# EAGLE design P1SwitchDemo (EAGLE 9.1.3)
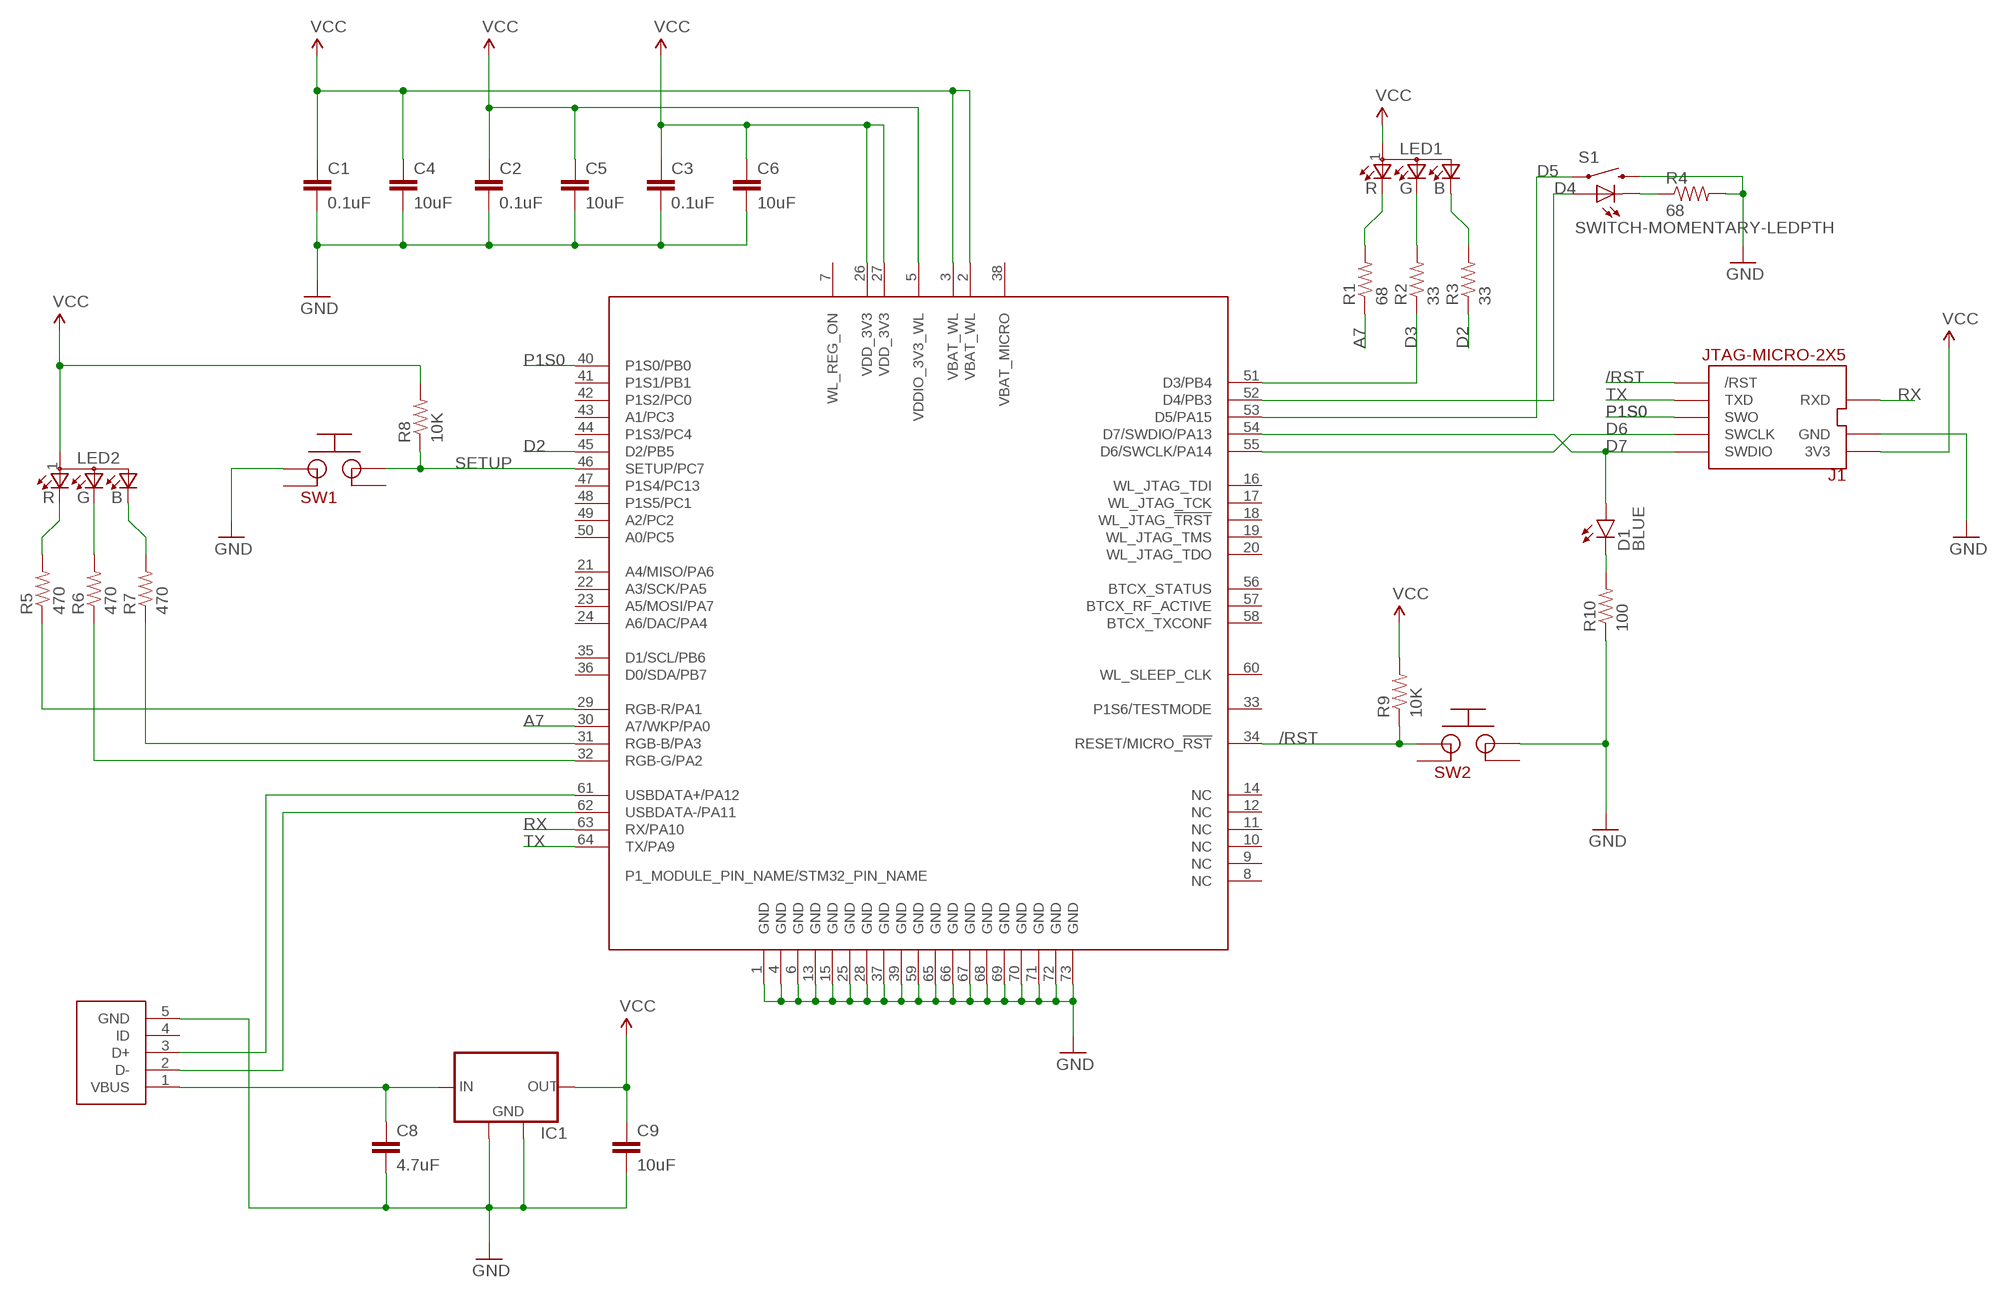
[diagram p0: schematic, sheet 1]

## Parts
C1  0.1uF  CAP-0.1UF-0603  [0603-CAP]
C2  0.1uF  CAP-0.1UF-0603  [0603-CAP]
C3  0.1uF  CAP-0.1UF-0603  [0603-CAP]
C4  10uF  CAP-10UF-0603  [0603-CAP]
C5  10uF  CAP-10UF-0603  [0603-CAP]
C6  10uF  CAP-10UF-0603  [0603-CAP]
C8  4.7uF  CAP-4.7UF-0603  [0603-CAP]
C9  10uF  CAP-10UF-0603  [0603-CAP]
D1  BLUE  LED-BLUE0603  [LED-0603]
IC1  MCP1825S-SOT223  [SOT223]
J1  JTAG-MICRO-2X5  [JTAG-MICRO-2X5]
LED1  LED-RGB-CREE-SMD  [LED-RGB-CREE-SMD]
LED2  LED-RGB-CREE-SMD  [LED-RGB-CREE-SMD]
R1  68  RES-68-0603.DEV  [0603-RES]
R2  33  RES-33-0603.DEV  [0603-RES]
R3  33  RES-33-0603.DEV  [0603-RES]
R4  68  RES-68-0603.DEV  [0603-RES]
R5  470  RES-470-0603  [0603-RES]
R6  470  RES-470-0603  [0603-RES]
R7  470  RES-470-0603  [0603-RES]
R8  10K  RES-10K-06030603  [0603-RES]
R9  10K  RES-10K-06030603  [0603-RES]
R10  100  RES-100-0603.DEV  [0603-RES]
S1  SWITCH-MOMENTARY-LEDPTH  [TACTILE-PTH-LED-12MM]
SW1  SWITCH-PTS645  [SWITCH-PTS645]
SW2  SWITCH-PTS645  [SWITCH-PTS645]
U$4  USB-MICRO-B-SOCKET-AMPHENOL  [USB-B-SMT-AMPHENOL]
U$6  P1  [WM-N-BM-14]

## Nets
/RST: J1.10(/RST) R9.1 SW2.1 U$6.34(RESET/MICRO_!RST!)
A7: R1.1 U$6.30(A7/WKP/PA0)
D2: R3.1 U$6.45(D2/PB5)
D3: R2.1 U$6.51(D3/PB4)
D4: S1.A U$6.52(D4/PB3)
D5: S1.4 U$6.53(D5/PA15)
D6: J1.4(SWCLK) U$6.55(D6/SWCLK/PA14)
D7: D1.A J1.2(SWDIO) U$6.54(D7/SWDIO/PA13)
GND: C1.2 C2.2 C3.2 C4.2 C5.2 C6.2 C8.2 C9.2 IC1.2(GND) IC1.4(GND) J1.3(GND) J1.5(GND) J1.9(GND) R4.2 R10.1 S1.2 SW1.1 SW2.3 U$4.5(GND) U$6.1(GND) U$6.4(GND) U$6.6(GND) U$6.13(GND) U$6.15(GND) U$6.25(GND) U$6.28(GND) U$6.37(GND) U$6.39(GND) U$6.59(GND) U$6.65(GND) U$6.66(GND) U$6.67(GND) U$6.68(GND) U$6.69(GND) U$6.70(GND) U$6.71(GND) U$6.72(GND) U$6.73(GND)
IN: C8.1 IC1.1(IN) U$4.1(VBUS)
N$4: LED2.4(R) R5.2
N$5: LED2.3(G) R6.2
N$6: LED2.2(B) R7.2
N$9: D1.C R10.2
N$12: LED1.4(R) R1.2
N$13: LED1.3(G) R2.2
N$14: LED1.2(B) R3.2
N$17: R4.1 S1.C
N$19: U$4.3(D+) U$6.61(USBDATA+/PA12)
N$20: U$4.2(D-) U$6.62(USBDATA-/PA11)
P1S0: J1.6(SWO) U$6.40(P1S0/PB0)
RGB-B: R7.1 U$6.31(RGB-B/PA3)
RGB-G: R6.1 U$6.32(RGB-G/PA2)
RGB-R: R5.1 U$6.29(RGB-R/PA1)
RX: J1.7(RXD) U$6.63(RX/PA10)
SETUP: R8.1 SW1.3 U$6.46(SETUP/PC7)
TX: J1.8(TXD) U$6.64(TX/PA9)
VCC: C1.1 C2.1 C3.1 C4.1 C5.1 C6.1 C9.1 IC1.3(OUT) J1.1(3V3) LED1.1(A) LED2.1(A) R8.2 R9.2 U$6.2(VBAT_WL) U$6.3(VBAT_WL) U$6.5(VDDIO_3V3_WL) U$6.26(VDD_3V3) U$6.27(VDD_3V3)
Unconnected: SW1.2 SW1.4 SW2.2 SW2.4 U$4.4(ID) U$6.7(WL_REG_ON) U$6.8(NC) U$6.9(NC) U$6.10(NC) U$6.11(NC) U$6.12(NC) U$6.14(NC) U$6.16(WL_JTAG_TDI) U$6.17(WL_JTAG_TCK) U$6.18(WL_JTAG_!TRST!) U$6.19(WL_JTAG_TMS) U$6.20(WL_JTAG_TDO) U$6.21(A4/MISO/PA6) U$6.22(A3/SCK/PA5) U$6.23(A5/MOSI/PA7) U$6.24(A6/DAC/PA4) U$6.33(P1S6/TESTMODE) U$6.35(D1/SCL/PB6) U$6.36(D0/SDA/PB7) U$6.38(VBAT_MICRO) U$6.41(P1S1/PB1) U$6.42(P1S2/PC0) U$6.43(A1/PC3) U$6.44(P1S3/PC4) U$6.47(P1S4/PC13) U$6.48(P1S5/PC1) U$6.49(A2/PC2) U$6.50(A0/PC5) U$6.56(BTCX_STATUS) U$6.57(BTCX_RF_ACTIVE) U$6.58(BTCX_TXCONF) U$6.60(WL_SLEEP_CLK)

## Library data of the parts
C1-C3 = rickk2:CAP-0.1UF-0603: CAP CER 0.1UF 16V X7R 0603 https://www.digikey.com/product-detail/en/murata-electronics-north-america/GRM188R71C104KA01D/490-1532-1-ND/587771
C4-C6 C9 = rickk2:CAP-10UF-0603: CAP CER 10UF 16V X5R 0805 $ 0.21 https://www.digikey.com/product-detail/en/murata-electronics-north-america/GRM21BR61C106KE15L/490-3886-1-ND/965928
C8 = rickk2:CAP-4.7UF-0603: Murata X5R series CAP CER 4.7UF 6.3V X5R 0603 $0.12 https://www.digikey.com/product-detail/en/murata-electronics-north-america/GRM188R60J475KE19J/490-6407-1-ND/3845604
D1 = rickk2:LED-BLUE: Lite-On LTST-C193TBKT-5A 0603 clear lens 6.25 mcd 130° viewing 15 mcd 5mA @ 2.8V $0.47 Blue 470nm LED Indication - Discrete 2.8V 0603 (1608 Metric) https://www.digikey.com/product-detail/en/lite-on-inc/LTST-C193TBKT-5A/160-1827-1-ND/2355044 R = 100 ohms @ 3.3V Stripe is on the anode (+) side on the bottom side!
IC1 = rickk2:MCP1825S: 500 mA, Low Voltage, Low Quiescent Current LDO Regulator IC REG LDO 3.3V 0.5A SOT-223-3 $ 0.53 https://www.digikey.com/products/en/integrated-circuits-ics/pmic-voltage-regulators-linear/699?k=MCP1825S&k=&pkeyword=MCP1825S&pv7=2&pv1989=0&pv1779=50&pv69=3&mnonly=0&ColumnSort=0&page=1&stock=1&quantity=0&ptm=0&fid=0&pageSize=25
J1 = rickk2:JTAG-MICRO-2X5: JTAG Connector $2.90 CONN HEADER SMD 10POS 1.27MM Connector Header Surface Mount 10 position 0.050" (1.27mm) Samtec FTSH-105-01-F-DV-K https://www.digikey.com/product-detail/en/FTSH-105-01-F-DV-K/SAM8796-ND/2649974?utm_campaign=buynow&WT.z_cid=ref_octopart_dkc_buynow&utm_medium=aggregator&curr=usd&site=us&utm_source=octopart
LED1 LED2 = rickk2:LED-RGB-CREE-SMD: LED RGB DIFFUSED 4SMD $ 0.35 Cree CLMVB-FKA-CFHEHLCBB7A363 2mm 4-PLCC common anode RGB LED https://www.digikey.com/product-detail/en/cree-inc/CLMVB-FKA-CFHEHLCBB7A363/CLMVB-FKA-CFHEHLCBB7A363CT-ND/6138627 Red=68 ohm, Green/Blue=33 ohm @ 3.3V
R1 R4 = rickk2:RES-68-0603.DEV: https://www.digikey.com/product-detail/en/panasonic-electronic-components/ERJ-3EKF68R0V/P68.0HCT-ND/1746805 Panasonic SMD 0603 1% 1/10W
R2 R3 = rickk2:RES-33-0603.DEV: https://www.digikey.com/product-detail/en/panasonic-electronic-components/ERJ-3EKF33R0V/P33.0HCT-ND/1746765 Panasonic SMD 0603 1% 1/10W
R5-R7 = rickk2:RES-470-0603: RES SMD 470 OHM 5% 1/10W 0603 Panasonic ERJ-3GEYJ471V 5% 0.1W, 1/10W Chip Resistor 0603 (1608 Metric) Automotive AEC-Q200 Thick Film https://www.digikey.com/product-detail/en/panasonic-electronic-components/ERJ-3GEYJ471V/P470GCT-ND/134802
R8 R9 = rickk2:RES-10K-0603: RES SMD 10K OHM 5% 1/4W 0603 $ 0.10 https://www.digikey.com/product-detail/en/panasonic-electronic-components/ERJ-PA3J103V/P10KBZCT-ND/5036237
R10 = rickk2:RES-100-0603.DEV: RES SMD 100 OHM 5% 1/10W 0603 $ 0.10 ±5% 0.1W, 1/10W Chip Resistor 0603 (1608 Metric) Automotive AEC-Q200 Thick Film https://www.digikey.com/product-detail/en/panasonic-electronic-components/ERJ-3GEYJ101V/P100GCT-ND/134714
S1 = rickk2:SWITCH-MOMENTARY-LED: EZ is for Kits. There is no tStop (covering up the top side of the pads with mask). This helps the beginner see which side they should be soldering too. Red $2.10 https://www.sparkfun.com/products/10442 Also green, blue, and white Available in orange but I don't have that one
SW1 SW2 = rickk2:SWITCH-PTS645: SWITCH TACTILE SPST-NO 0.05A 12V $ 0.21 C&K PTS645SH50SMTR92 LFS Gray button, tactile, surface mount, 6mm x 6mm, 0.05A @ 12VDC, gull wing, top actuated https://www.digikey.com/product-detail/en/c-k/PTS645SH50SMTR92-LFS/CKN9085CT-ND/1146817
U$4 = rickk2:USB-MICRO-B-SOCKET-AMPHENOL: CONN USB MICRO B RECPT SMT R/A $0.42 Amphenol FCI 10118194-0001LF https://www.digikey.com/products/en?keywords=609-4618-1-nd
U$6 = rickk2:P1: Particle P1 module (WiFi with antenna)

## Board
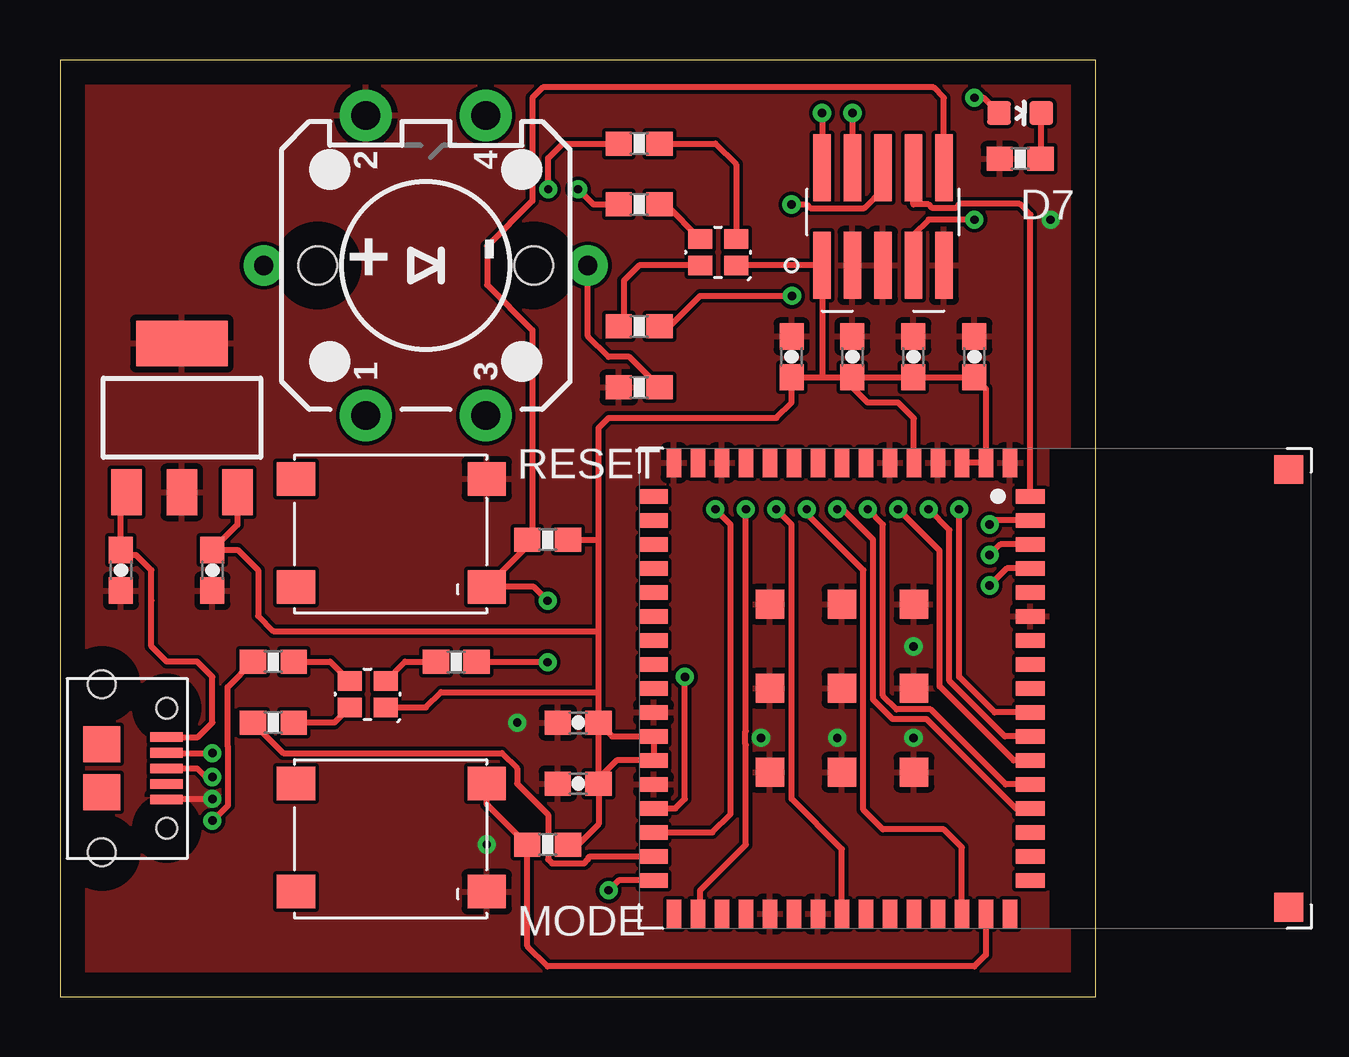
[diagram p1: board, top side]
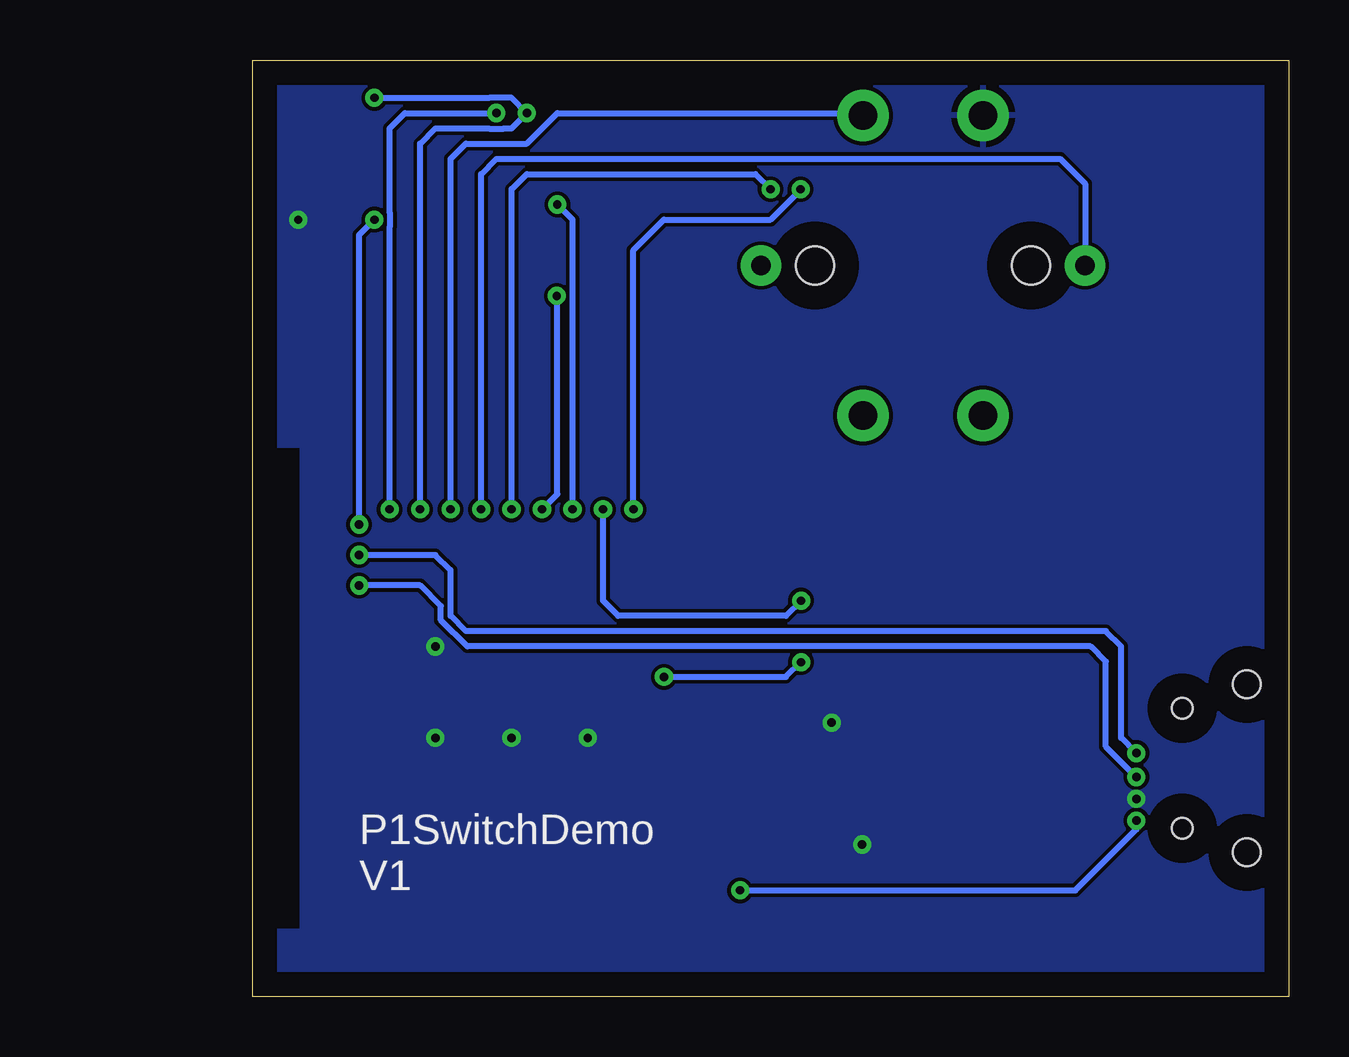
[diagram p2: board, bottom side, seen from below]

Size 43.16 x 39.04 mm. Coordinates in mm from the lower left corner, seen from the top.
Outline: 0,0 43.16,0 43.16,39.04 0,39.04 0,0
Copper layers (1*16): Top 0.035mm / dielectric 1.5mm / Bottom 0.035mm
Design rules "default": minimum track width 6mil, minimum drill 0.35mm, track to track 6mil, track to pad 6mil, pad to pad 6mil, via to via 6mil, smd to smd 6mil, copper to edge 40mil, drill to drill 6mil, minimum pad ring 10mil, minimum via ring 8mil, stop-mask expansion 4mil, vias tented up to drill 0mil, thermal gap 10mil

### Footprints (pad centres in the part's own frame; a part is rotated, then mirrored left to right if it is on the bottom)
0603-CAP = smd 1.1 x 1: 1 -0.85,0; 2 0.85,0
LED-0603 = smd 1 x 1: A 0,-0.877; C 0,0.877
SOT223 = smd 1.27 x 1.905: 1 -2.311,-3.099; 2 0,-3.099; 3 2.311,-3.099 | smd 3.81 x 1.905: 4 0,3.099
JTAG-MICRO-2X5 = smd 0.737 x 2.794: 1 0,0; 2 0,4.064; 3 1.27,0; 4 1.27,4.064; 5 2.54,0; 6 2.54,4.064; 7 3.81,0; 8 3.81,4.064; 9 5.08,0; 10 5.08,4.064
LED-RGB-CREE-SMD = smd 1 x 0.8: 1 1.5,0; 2 0,0; 3 0,1.1; 4 1.5,1.1
0603-RES = smd 1.1 x 1: 1 -0.85,0; 2 0.85,0
TACTILE-PTH-LED-12MM = drill 1.2 pad 2.159: 1 -6.25,2.5; 2 6.25,2.5; 3 -6.25,-2.5; 4 6.25,-2.5 | drill 0.8 pad 1.676: A 0,6.75; C 0,-6.75 | hole 1.6: 0,4.5; 0,-4.5
SWITCH-PTS645 = smd 1.6 x 1.4: 1 0,4.5; 2 7.95,4.5; 3 0,0; 4 7.95,0
USB-B-SMT-AMPHENOL = smd 0.4 x 1.35: 1 -1.3,0; 2 -0.65,0; 3 0,0; 4 0.65,0; 5 1.3,0 | smd 1.5 x 1.55: P$6 -1,-2.7; P$7 1,-2.7 | hole 0.85: -2.5,0; 2.5,0 | hole 1.15: -3.5,-2.7; 3.5,-2.7
WM-N-BM-14 = smd 1.2 x 0.6: 1 0.6,15.45; 2 0.6,14.45; 3 0.6,13.45; 4 0.6,12.45; 5 0.6,11.45; 6 0.6,10.45; 7 0.6,9.45; 8 0.6,8.45; 9 0.6,7.45; 10 0.6,6.45; 11 0.6,5.45; 12 0.6,4.45; 13 0.6,3.45; 14 0.6,2.45; 15 0.6,1.45; 33 19.4,1.45; 34 19.4,2.45; 35 19.4,3.45; 36 19.4,4.45; 37 19.4,5.45; 38 19.4,6.45; 39 19.4,7.45; 40 19.4,8.45; 41 19.4,9.45; 42 19.4,10.45; 43 19.4,11.45; 44 19.4,12.45; 45 19.4,13.45; 46 19.4,14.45; 47 19.4,15.45 | smd 0.6 x 1.2: 16 2,0.6; 17 3,0.6; 18 4,0.6; 19 5,0.6; 20 6,0.6; 21 7,0.6; 22 8,0.6; 23 9,0.6; 24 10,0.6; 25 11,0.6; 26 12,0.6; 27 13,0.6; 28 14,0.6; 29 15,0.6; 30 16,0.6; 31 17,0.6; 32 18,0.6; 48 18,16.3; 49 17,16.3; 50 16,16.3; 51 15,16.3; 52 14,16.3; 53 13,16.3; 54 12,16.3; 55 11,16.3; 56 10,16.3; 57 9,16.3; 58 8,16.3; 59 7,16.3; 60 6,16.3; 61 5,16.3; 62 4,16.3; 63 3,16.3; 64 2,16.3 | smd 1.2 x 1.2: 65 6.5,11.45; 66 6.5,8.45; 67 6.5,5.45; 68 10,11.45; 69 10,8.45; 70 10,5.45; 71 13.5,11.45; 72 13.5,8.45; 73 13.5,5.45; 74 19.12,27.07; 75 0.88,27.07

### Placement (x,y rotation side)
C1  35.56,26.67 90 top
C2  33.02,26.67 90 top
C3  21.59,11.43 180 top
C4  38.1,26.67 90 top
C5  30.48,26.67 90 top
C6  21.59,8.89 180 top
C8  2.54,17.78 270 top
C9  6.35,17.78 270 top
D1  40.01,36.83 270 top
IC1  5.08,24.13 0 top
J1  31.75,30.48 0 top
LED1  26.67,30.48 0 top
LED2  12.06,12.06 0 top
R1  24.13,35.56 0 top
R2  24.13,33.02 0 top
R3  24.13,27.94 180 top
R4  24.13,25.4 180 top
R5  16.51,13.97 180 top
R6  8.89,13.97 0 top
R7  8.89,11.43 0 top
R8  20.32,6.35 0 top
R9  20.32,19.05 0 top
R10  40.01,34.92 0 top
S1  15.24,30.48 90 top
SW1  17.78,8.89 180 top
SW2  17.78,21.59 180 top
U$4  4.45,9.53 270 top
U$6  24.13,22.86 270 top

### Tracks (layer width: path | path; a pad name or v marks a point on that pad's centre or on a via)
/RST  (via drill 0.35)
  Top 0.254: J1.10 36.83,37.47 36.4,37.9 20.12,37.9 19.68,37.47 19.68,33.17 17.8,31.29 17.8,29.68 19.68,27.79 19.68,19.27 R9.1 19.47,18.78 SW2.1 19.74,17.09 v20.32,16.51 | U$6.34 26.67,3.55 26.67,4.45 28.57,6.35 28.57,10.5 28.55,10.52 28.55,11.07 28.57,11.09 v28.57,20.32
  Bottom 0.254: v20.32,16.51 20.95,15.88 27.94,15.88 28.57,16.51 v28.57,20.32
A7  (via drill 0.35)
  Top 0.254: v27.3,20.32 27.94,19.68 27.94,7.62 27.18,6.86 U$6.30 | v20.34,33.66 20.34,34.95 20.95,35.56 R1.1
  Bottom 0.254: v27.3,20.32 27.3,31.11 26.04,32.38 21.59,32.38 20.32,33.66 v20.34,33.66
D2  (via drill 0.35)
  Top 0.254: v31.11,20.32 31.11,20.14 33.48,17.78 33.48,7.8 34.29,6.99 36.83,6.99 37.58,6.24 U$6.45 | R3.1 25.4,27.94 26.67,29.21 v30.5,29.21
  Bottom 0.254: v31.11,20.32 30.48,20.95 30.48,29.21 v30.5,29.21
D3  (via drill 0.35)
  Top 0.254: v32.38,20.32 32.61,20.32 33.88,19.05 33.88,12.39 34.7,11.57 36.11,11.57 39.83,7.86 U$6.51 | v21.59,33.66 22.23,33.02 R2.1
  Bottom 0.254: v21.59,33.66 22.23,34.29 31.75,34.29 32.38,33.66 v32.38,20.32
D4  (via drill 0.35)
  Top 0.254: U$6.52 39.4,8.86 36.28,11.98 34.86,11.98 34.29,12.55 34.29,19.68 v33.66,20.32
  Bottom 0.254: v33.66,20.32 33.66,34.29 33.02,34.92 9.53,34.92 8.49,33.89 S1.A
D5  (via drill 0.35)
  Top 0.254: v34.92,20.32 36.65,18.59 36.65,12.94 39.73,9.86 U$6.53
  Bottom 0.254: v34.92,20.32 34.92,34.92 34.29,35.56 31.75,35.56 30.48,36.83 17.84,36.83 S1.4
D6  (via drill 0.35)
  Top 0.254: U$6.55 38.94,11.86 37.47,13.34 v37.47,20.32 | v33.02,36.83 J1.4
  Bottom 0.254: v37.47,20.32 37.47,32.09 37.44,32.11 37.44,32.66 37.47,32.68 37.47,36.2 36.83,36.83 v33.02,36.83
D7  (via drill 0.35)
  Top 0.254: v36.2,20.32 37.06,19.46 37.06,13.17 39.37,10.86 39.38,10.86 U$6.54 | v31.75,36.83 J1.2 | D1.A 38.49,37.47 v38.1,37.47
  Bottom 0.254: v36.2,20.32 36.2,35.56 35.56,36.2 33.31,36.2 33.29,36.17 32.75,36.17 32.73,36.2 32.38,36.2 v31.75,36.83 32.41,37.49 33.29,37.49 33.31,37.47 v38.1,37.47
GND  (via drill 0.35)
  Top 0.254: U$4.5 4.47,8.26 v6.35,8.26
  other vias: 29.21,10.79 32.38,10.79 35.56,10.79 41.27,32.38 19.05,11.43 17.78,6.35 35.56,14.61
  pour Top: 0,0 0,40.64 45.72,40.64 45.72,0
  pour Bottom: 0,0 0,41.91 46.99,41.91 46.99,0
IN
  Top 0.254: U$4.1 5.75,10.82 6.35,11.43 6.35,13.34 5.71,13.97 4.45,13.97 3.81,14.61 3.81,16.51 3.81,17.78 3.17,18.41 2.75,18.41 C8.1 2.54,20.8 IC1.1
N$4
  Top 0.254: LED2.4 14.37,13.97 R5.2
N$5
  Top 0.254: R6.2 11.26,13.97 LED2.3
N$6
  Top 0.254: LED2.2 11.43,11.43 R7.2
N$9
  Top 0.254: D1.C 40.85,36.8 R10.2
N$12
  Top 0.254: R1.2 27.3,35.56 28.17,34.7 LED1.4
N$13
  Top 0.254: R2.2 25.23,33.02 LED1.3
N$14
  Top 0.254: LED1.2 24.13,30.48 23.5,29.84 23.5,28.16 R3.2
N$17
  Top 0.254: R4.1 23.71,26.67 22.86,26.67 21.99,27.54 S1.C
N$19  (via drill 0.35)
  Top 0.254: U$6.61 39.45,17.86 v38.73,17.14 | U$4.3 5.71,9.53 6.33,8.91 6.35,8.91 v6.35,9.16
  Bottom 0.254: v6.35,9.16 7.62,10.43 7.62,13.97 8.26,14.61 34.23,14.61 35.33,15.71 35.33,16.28 36.2,17.14 v38.73,17.14
N$20  (via drill 0.35)
  Top 0.254: U$6.62 39.18,18.86 v38.73,18.41 | U$4.2 4.46,10.16 v6.35,10.16
  Bottom 0.254: v6.35,10.16 6.99,10.79 6.99,14.61 7.62,15.24 34.29,15.24 34.92,15.88 34.92,17.78 35.56,18.41 v38.73,18.41
P1S0  (via drill 0.35)
  Top 0.254: v30.48,33.02 31.11,33.02 31.27,32.87 33.5,32.87 34.29,33.65 J1.6 | U$6.40 32.58,6.16 30.48,8.26 30.48,19.68 v29.84,20.32
  Bottom 0.254: v29.84,20.32 29.84,32.38 v30.48,33.02
RGB-B
  Top 0.254: R7.1 9.31,10.16 18.41,10.16 19.05,9.53 19.05,8.89 20.34,7.6 20.34,5.73 20.5,5.57 21.84,5.57 22,5.73 22,5.78 22.08,5.86 U$6.31
RGB-G  (via drill 0.35)
  Top 0.254: U$6.32 23.27,4.86 v22.86,4.45 | v6.35,7.35 6.6,7.6 6.62,7.6 7.01,7.98 7.01,10.43 6.99,10.46 6.99,12.91 R6.1
  Bottom 0.254: v22.86,4.45 8.89,4.45 6.35,6.99 v6.35,7.35
RGB-R  (via drill 0.35)
  Top 0.254: U$6.29 25.64,7.86 26.04,8.26 v26.04,13.34 | v20.32,13.95 17.38,13.95 R5.1
  Bottom 0.254: v26.04,13.34 20.95,13.34 20.32,13.97 v20.32,13.95
RX  (via drill 0.35)
  Top 0.254: U$6.63 38.91,19.86 v38.73,19.68 | v38.1,32.38 36.2,32.38 35.56,31.75 J1.7
  Bottom 0.254: v38.73,19.68 38.73,31.75 v38.1,32.38
SETUP
  Top 0.254: U$6.46 38.58,1.75 38.1,1.27 20.32,1.27 19.47,2.12 R8.1 17.78,8.04 SW1.3
TX
  Top 0.254: U$6.64 40.43,32.59 39.98,33.04 37.49,33.04 37.31,32.87 36.35,32.87 36.19,33.02 35.56,33.02 J1.8
VCC
  Top 0.254: 31.75,25.82 C5.1 30.48,24.77 29.84,24.13 22.86,24.13 22.44,23.71 22.44,19.05 | 31.75,25.82 C2.1 | U$6.3 U$6.2 38.58,25.34 C4.1 C1.1 C2.1 | U$6.5 35.58,24.11 34.92,24.77 33.66,24.77 33.02,25.4 C2.1 | 31.75,25.82 J1.1 LED1.1 | C3.1 23.01,10.86 U$6.26 U$6.27 23.2,9.86 22.44,9.11 C6.1 | C6.1 C3.1 | C3.1 22.44,12.7 | 22.44,12.7 22.44,15.24 | 22.44,15.24 22.44,19.05 | R9.2 22.44,19.05 | LED2.1 15.24,12.06 15.88,12.7 22.44,12.7 | C6.1 22.44,7.2 21.59,6.35 R8.2 | IC1.3 7.39,19.67 C9.1 7.41,18.63 8.26,17.78 8.26,15.88 8.89,15.24 22.44,15.24

### Text on the board
tPlace: D7 | RESET | MODE
bPlace: P1SwitchDemo / V1